# EAGLE board usb-fpga-1.20 (EAGLE 4.15), part 1 of 2
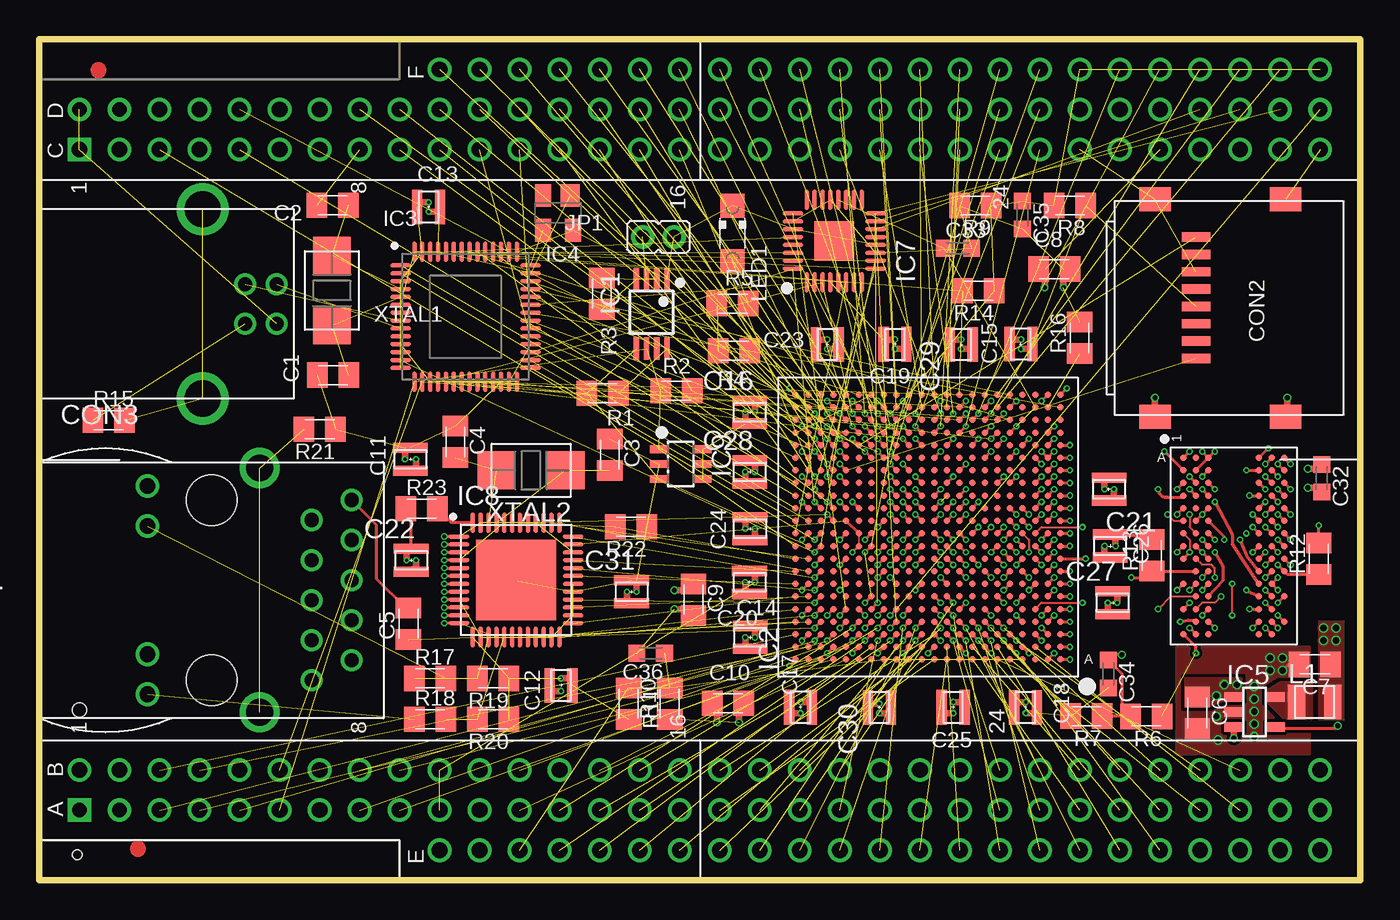
[diagram p8: board, top side]
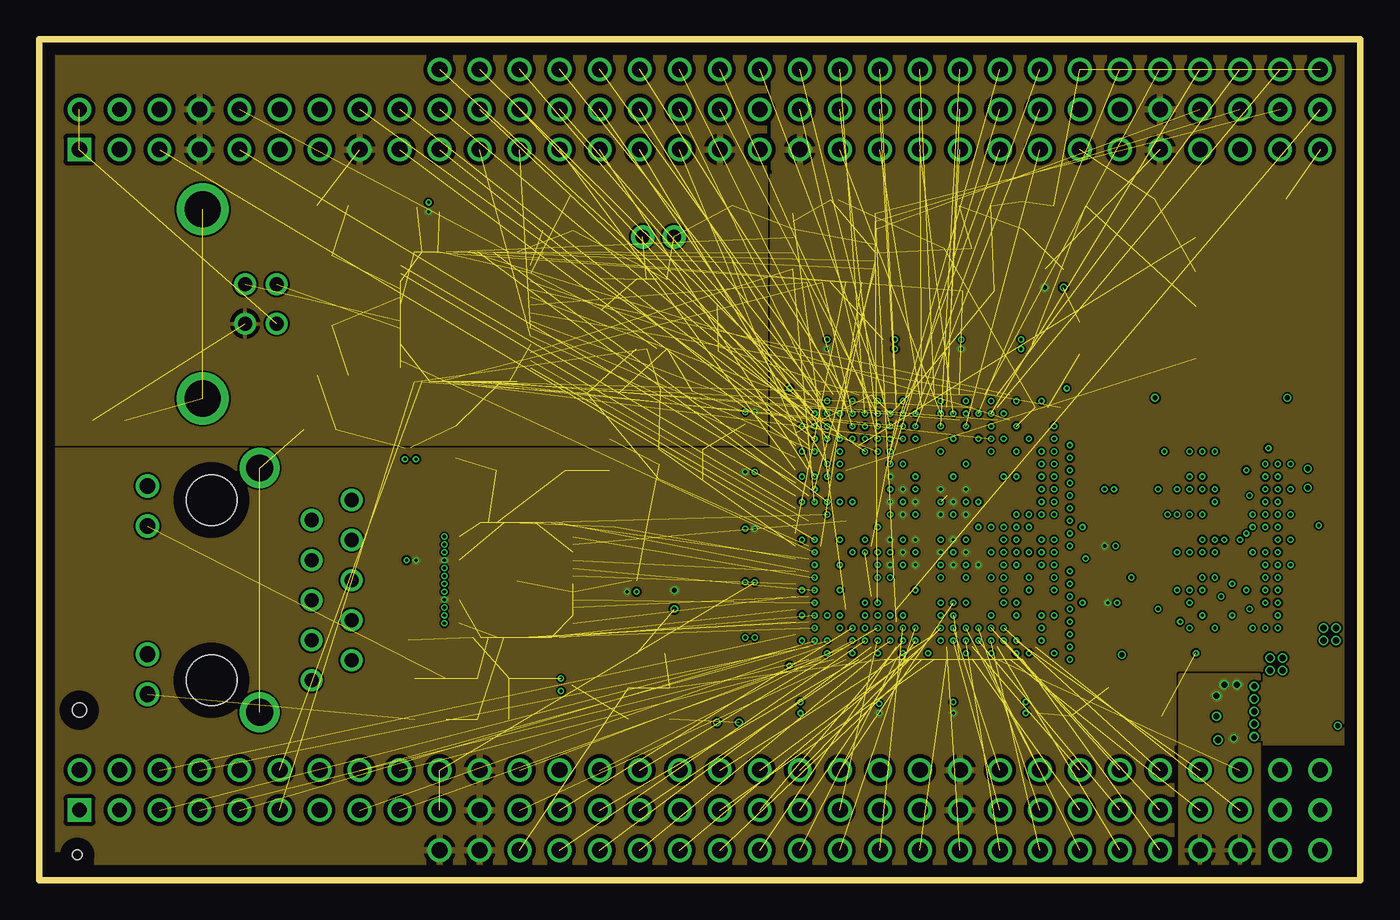
[diagram p9: board, inner layer Sup1]
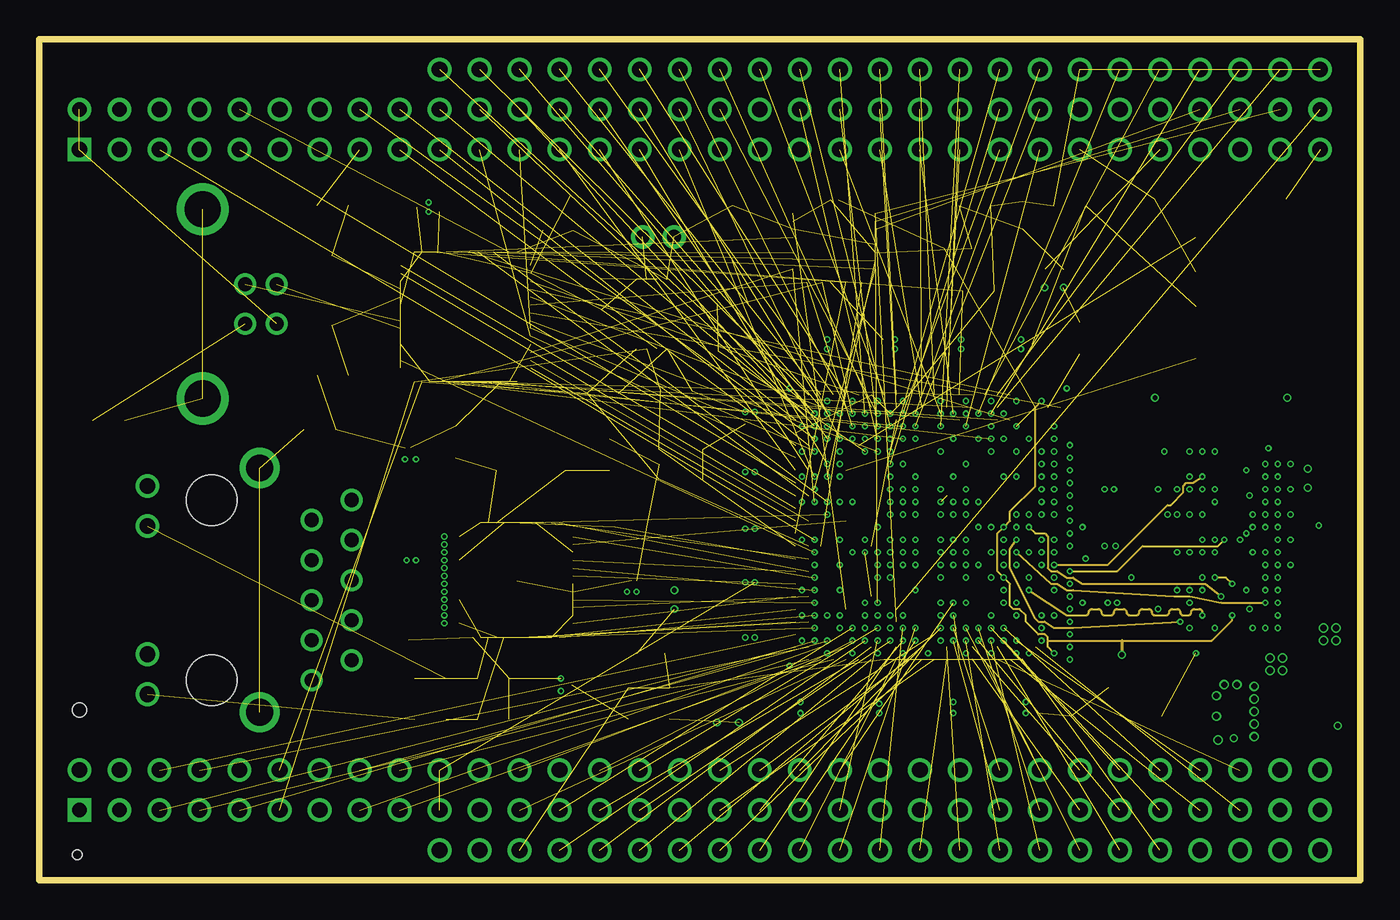
[diagram p10: board, inner layer Sig1]
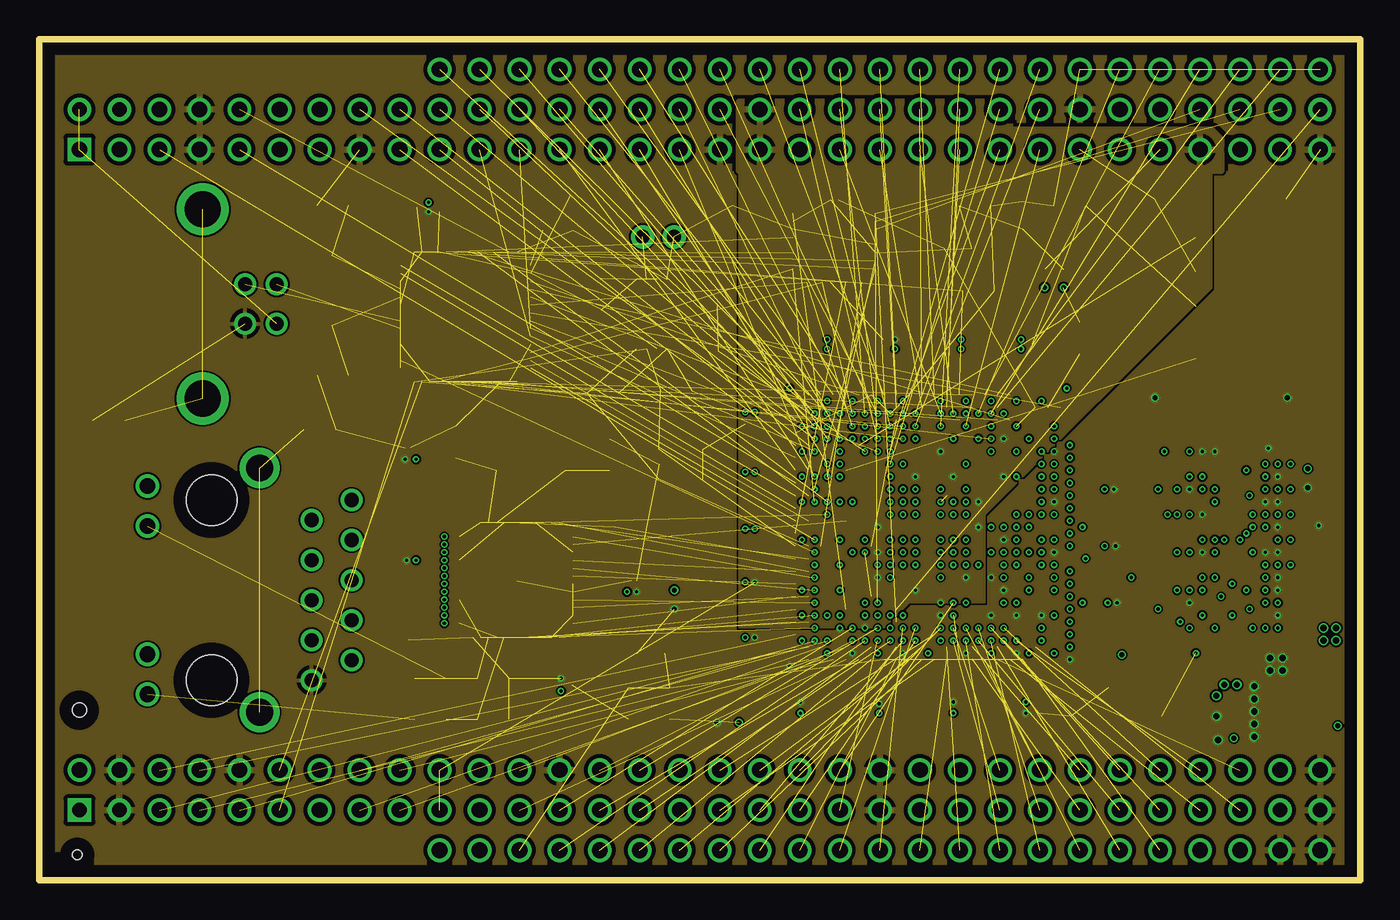
[diagram p11: board, inner layer Sup2]
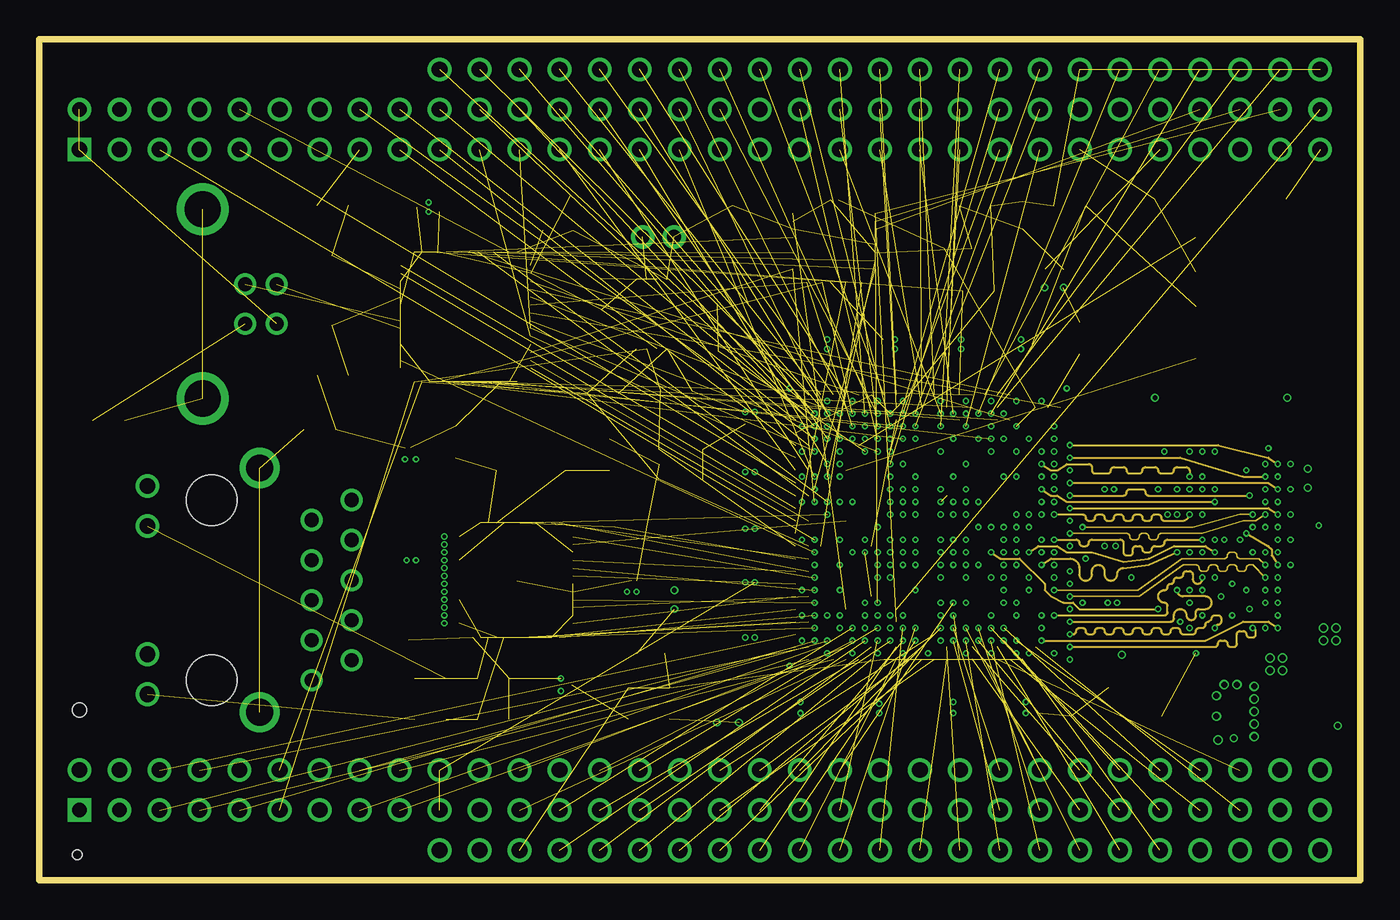
[diagram p12: board, inner layer Sig2]
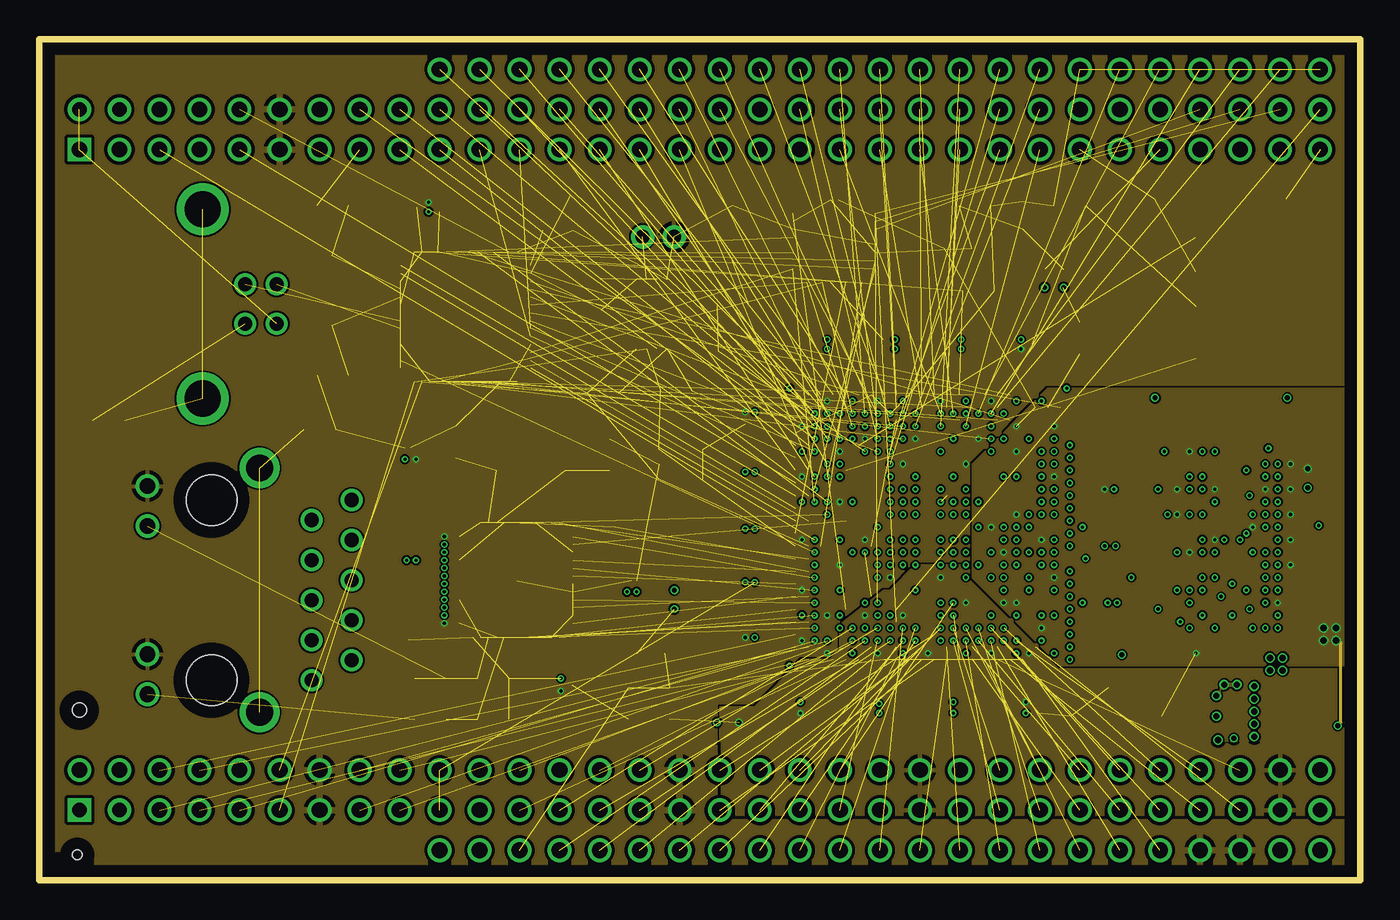
[diagram p13: board, inner layer Sup3]
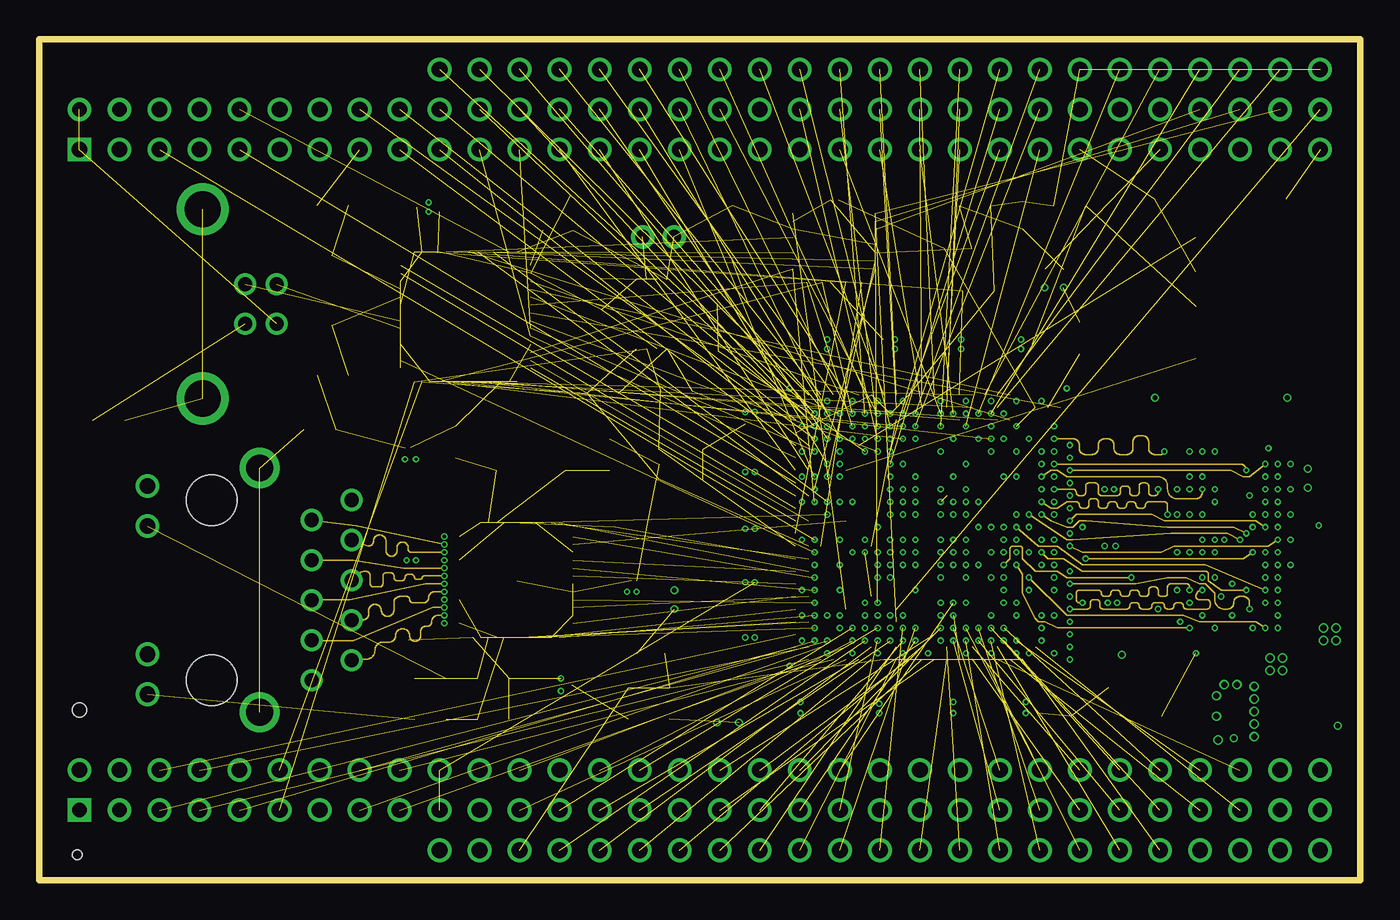
[diagram p14: board, inner layer Sig3]
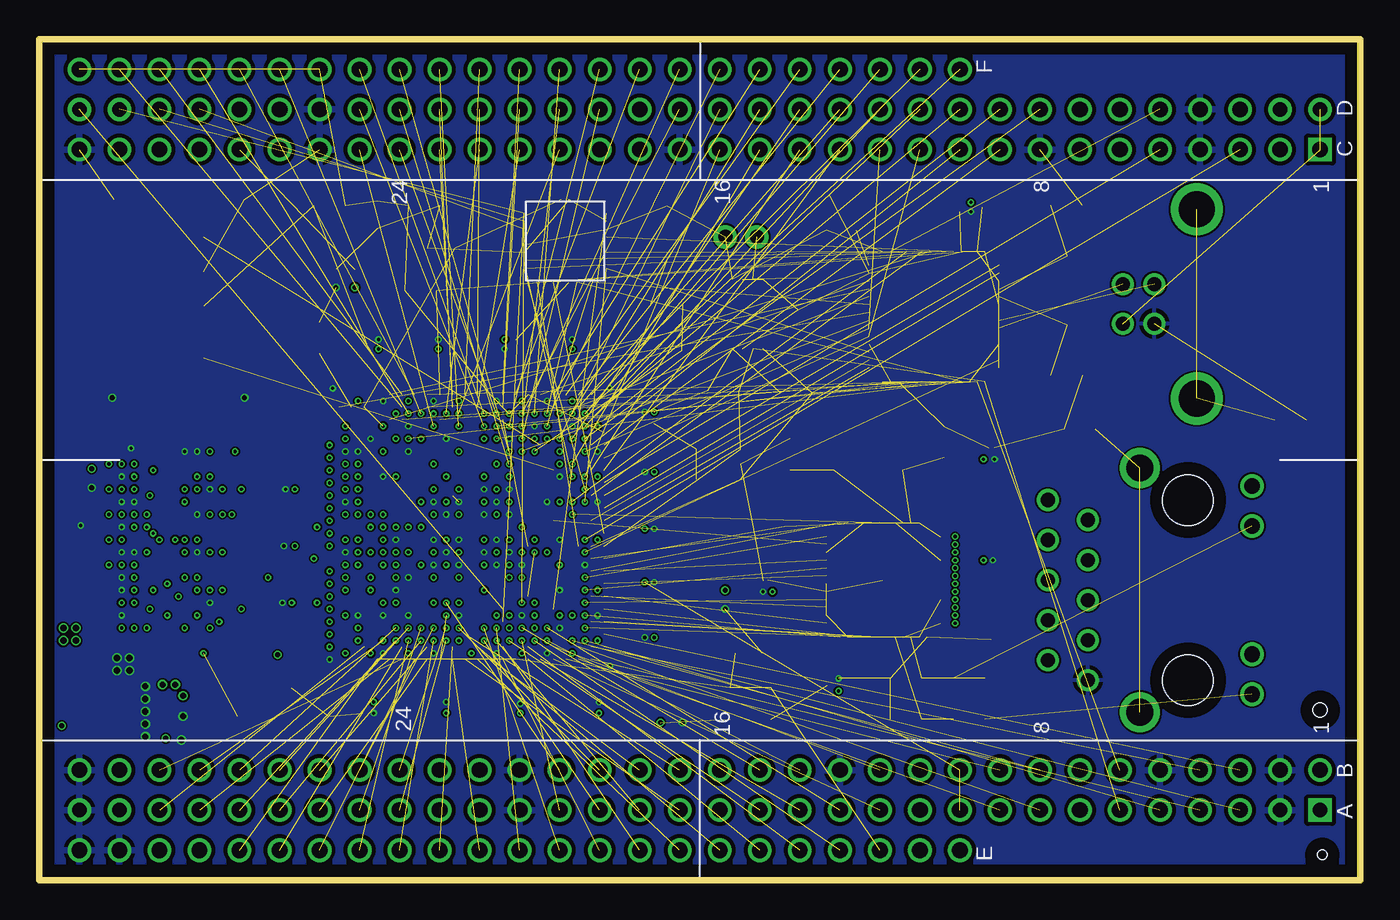
[diagram p15: board, bottom side, seen from below]

Size 83.82 x 53.34 mm. Coordinates in mm from the lower left corner, seen from the top.
Outline: 0,53.34 0,0 83.82,0 83.82,53.34 0,53.34
Copper layers (1+2*3+4*13+14*15+16): Top 0.035mm / dielectric 0.18mm / Sup1 0.035mm / dielectric 0.18mm / Sig1 0.035mm / dielectric 0.23mm / Sup2 0.035mm / dielectric 0.18mm / Sig2 0.035mm / dielectric 0.23mm / Sup3 0.035mm / dielectric 0.18mm / Sig3 0.035mm / dielectric 0.18mm / Sup4 (Bottom) 0.035mm
Design rules "dr": minimum track width 0.11mm, minimum drill 0.2mm, track to track 0.11mm, track to pad 0.125mm, pad to pad 0.125mm, via to via 0.1mm, smd to smd 2mil, copper to edge 31mil, drill to drill 0.3mm, minimum pad ring 10mil, minimum via ring 0.1mm, stop-mask expansion 3mil, vias tented up to drill 17mil, thermal gap 10mil
Net classes: 0 default: width 0.1 mm; 4 ddr: width 0.1 mm; 6 diff: width 0.11 mm
Holes 0.6 mm at 2.4,1.6

## Footprints (pad centres in the part's own frame; a part is rotated, then mirrored left to right if it is on the bottom)
C0805K = smd 1.3 x 1.6: 1 -1,0; 2 1,0
0508K = smd 2.2 x 0.65: P$1 0,-0.725; P$2 0,0.725
C0603K = smd 1.05 x 1.08: 1 -0.875,0; 2 0.875,0
USB-FPGA1.15 = drill 0.925 pad 1.5 square: A1 2.54,1.905 | drill 0.925 pad 1.5 round: A2 5.08,1.905; A31 78.74,1.905; A32 81.28,1.905; D1 2.54,46.355; D2 5.08,46.355; D31 78.74,46.355; D32 81.28,46.355 | drill 1 pad 1.5 round: A3 7.62,1.905; A4 10.16,1.905; A5 12.7,1.905; A6 15.24,1.905; A7 17.78,1.905; A8 20.32,1.905; A9 22.86,1.905; A10 25.4,1.905; A11 27.94,1.905; A12 30.48,1.905; A13 33.02,1.905; A14 35.56,1.905; A15 38.1,1.905; A16 40.64,1.905; A17 43.18,1.905; A18 45.72,1.905; A19 48.26,1.905; A20 50.8,1.905; A21 53.34,1.905; A22 55.88,1.905; A23 58.42,1.905; A24 60.96,1.905; A25 63.5,1.905; A26 66.04,1.905; A27 68.58,1.905; A28 71.12,1.905; A29 73.66,1.905; A30 76.2,1.905; B1 2.54,4.445; B2 5.08,4.445; B3 7.62,4.445; B4 10.16,4.445; B5 12.7,4.445; B6 15.24,4.445; B7 17.78,4.445; B8 20.32,4.445; B9 22.86,4.445; B10 25.4,4.445; B11 27.94,4.445; B12 30.48,4.445; B13 33.02,4.445; B14 35.56,4.445; B15 38.1,4.445; B16 40.64,4.445; B17 43.18,4.445; B18 45.72,4.445; B19 48.26,4.445; B20 50.8,4.445; B21 53.34,4.445; B22 55.88,4.445; B23 58.42,4.445; B24 60.96,4.445; B25 63.5,4.445; B26 66.04,4.445; B27 68.58,4.445; B28 71.12,4.445; B29 73.66,4.445; B30 76.2,4.445; B31 78.74,4.445; B32 81.28,4.445; C2 5.08,43.815; C3 7.62,43.815; C4 10.16,43.815; C5 12.7,43.815; C6 15.24,43.815; C7 17.78,43.815; C8 20.32,43.815; C9 22.86,43.815; C10 25.4,43.815; C11 27.94,43.815; C12 30.48,43.815; C13 33.02,43.815; C14 35.56,43.815; C15 38.1,43.815; C16 40.64,43.815; C17 43.18,43.815; C18 45.72,43.815; C19 48.26,43.815; C20 50.8,43.815; C21 53.34,43.815; C22 55.88,43.815; C23 58.42,43.815; C24 60.96,43.815; C25 63.5,43.815; C26 66.04,43.815; C27 68.58,43.815; C28 71.12,43.815; C29 73.66,43.815; C30 76.2,43.815; C31 78.74,43.815; C32 81.28,43.815; D3 7.62,46.355; D4 10.16,46.355; D5 12.7,46.355; D6 15.24,46.355; D7 17.78,46.355; D8 20.32,46.355; D9 22.86,46.355; D10 25.4,46.355; D11 27.94,46.355; D12 30.48,46.355; D13 33.02,46.355; D14 35.56,46.355; D15 38.1,46.355; D16 40.64,46.355; D17 43.18,46.355; D18 45.72,46.355; D19 48.26,46.355; D20 50.8,46.355; D21 53.34,46.355; D22 55.88,46.355; D23 58.42,46.355; D24 60.96,46.355; D25 63.5,46.355; D26 66.04,46.355; D27 68.58,46.355; D28 71.12,46.355; D29 73.66,46.355; D30 76.2,46.355; E10 25.4,-0.635; E11 27.94,-0.635; E12 30.48,-0.635; E13 33.02,-0.635; E14 35.56,-0.635; E15 38.1,-0.635; E16 40.64,-0.635; E17 43.18,-0.635; E18 45.72,-0.635; E19 48.26,-0.635; E20 50.8,-0.635; E21 53.34,-0.635; E22 55.88,-0.635; E23 58.42,-0.635; E24 60.96,-0.635; E25 63.5,-0.635; E26 66.04,-0.635; E27 68.58,-0.635; E28 71.12,-0.635; E29 73.66,-0.635; E30 76.2,-0.635; E31 78.74,-0.635; E32 81.28,-0.635; F10 25.4,48.895; F11 27.94,48.895; F12 30.48,48.895; F13 33.02,48.895; F14 35.56,48.895; F15 38.1,48.895; F16 40.64,48.895; F17 43.18,48.895; F18 45.72,48.895; F19 48.26,48.895; F20 50.8,48.895; F21 53.34,48.895; F22 55.88,48.895; F23 58.42,48.895; F24 60.96,48.895; F25 63.5,48.895; F26 66.04,48.895; F27 68.58,48.895; F28 71.12,48.895; F29 73.66,48.895; F30 76.2,48.895; F31 78.74,48.895; F32 81.28,48.895 | drill 1 pad 1.5 square: C1 2.54,43.815 | hole 0.9: 2.54,8.255
MICROSD-MULTICOMP = smd 0.6 x 1.8: 1 3.2,-1.85; 2 2.1,-1.85; 3 1,-1.85; 4 -0.1,-1.85; 5 -1.2,-1.85; 6 -2.3,-1.85; 7 -3.4,-1.85; 8 -4.5,-1.85 | smd 1.5 x 2: CD1 6.9,-4.45; CD2 -6.9,-4.45; SGD2 6.9,3.85; SHD1 -6.9,3.85
USB-HORIZ = drill 0.9 round: 1 15,-1.25; 2 15,1.25; 3 13,1.25; 4 13,-1.25 | drill 2.3 round: SHD1 10.3,6; SHD2 10.3,-6
RJ45-MAG = drill 0.9 round: 1 19.812,5.715; 2 17.272,4.445; 3 19.812,3.175; 4 17.272,1.905; 5 19.812,0.635; 6 17.272,-0.635; 7 19.812,-1.905; 8 17.272,-3.175; 9 19.812,-4.445; 10 17.272,-5.715 | drill 1 round: LED1A 6.858,6.604; LED1K 6.858,4.064; LED2A 6.858,-4.064; LED2K 6.858,-6.604 | drill 1.7 round: SH1 13.97,-7.747; SH2 13.97,7.747 | hole 3.2: 10.922,-5.715; 10.922,5.715
MSOP8 = smd 0.325 x 1.4: 1 -0.975,-2.2; 2 -0.325,-2.2; 3 0.325,-2.2; 4 0.975,-2.2; 5 0.975,2.2; 6 0.325,2.2; 7 -0.325,2.2; 8 -0.975,2.2
CSG484 = smd 0.4 x 0.4: A1 -8.4,8.4; A2 -7.6,8.4; A3 -6.8,8.4; A4 -6,8.4; A5 -5.2,8.4; A6 -4.4,8.4; A7 -3.6,8.4; A8 -2.8,8.4; A9 -2,8.4; A10 -1.2,8.4; A11 -0.4,8.4; A12 0.4,8.4; A13 1.2,8.4; A14 2,8.4; A15 2.8,8.4; A16 3.6,8.4; A17 4.4,8.4; A18 5.2,8.4; A19 6,8.4; A20 6.8,8.4; A21 7.6,8.4; A22 8.4,8.4; AA1 -8.4,-7.6; AA2 -7.6,-7.6; AA3 -6.8,-7.6; AA4 -6,-7.6; AA5 -5.2,-7.6; AA6 -4.4,-7.6; AA7 -3.6,-7.6; AA8 -2.8,-7.6; AA9 -2,-7.6; AA10 -1.2,-7.6; AA11 -0.4,-7.6; AA12 0.4,-7.6; AA13 1.2,-7.6; AA14 2,-7.6; AA15 2.8,-7.6; AA16 3.6,-7.6; AA17 4.4,-7.6; AA18 5.2,-7.6; AA19 6,-7.6; AA20 6.8,-7.6; AA21 7.6,-7.6; AA22 8.4,-7.6; AB1 -8.4,-8.4; AB2 -7.6,-8.4; AB3 -6.8,-8.4; AB4 -6,-8.4; AB5 -5.2,-8.4; AB6 -4.4,-8.4; AB7 -3.6,-8.4; AB8 -2.8,-8.4; AB9 -2,-8.4; AB10 -1.2,-8.4; AB11 -0.4,-8.4; AB12 0.4,-8.4; AB13 1.2,-8.4; AB14 2,-8.4; AB15 2.8,-8.4; AB16 3.6,-8.4; AB17 4.4,-8.4; AB18 5.2,-8.4; AB19 6,-8.4; AB20 6.8,-8.4; AB21 7.6,-8.4; AB22 8.4,-8.4; B1 -8.4,7.6; B2 -7.6,7.6; B3 -6.8,7.6; B4 -6,7.6; B5 -5.2,7.6; B6 -4.4,7.6; B7 -3.6,7.6; B8 -2.8,7.6; B9 -2,7.6; B10 -1.2,7.6; B11 -0.4,7.6; B12 0.4,7.6; B13 1.2,7.6; B14 2,7.6; B15 2.8,7.6; B16 3.6,7.6; B17 4.4,7.6; B18 5.2,7.6; B19 6,7.6; B20 6.8,7.6; B21 7.6,7.6; B22 8.4,7.6; C1 -8.4,6.8; C2 -7.6,6.8; C3 -6.8,6.8; C4 -6,6.8; C5 -5.2,6.8; C6 -4.4,6.8; C7 -3.6,6.8; C8 -2.8,6.8; C9 -2,6.8; C10 -1.2,6.8; C11 -0.4,6.8; C12 0.4,6.8; C13 1.2,6.8; C14 2,6.8; C15 2.8,6.8; C16 3.6,6.8; C17 4.4,6.8; C18 5.2,6.8; C19 6,6.8; C20 6.8,6.8; C21 7.6,6.8; C22 8.4,6.8; D1 -8.4,6; D2 -7.6,6; D3 -6.8,6; D4 -6,6; D5 -5.2,6; D6 -4.4,6; D7 -3.6,6; D8 -2.8,6; D9 -2,6; D10 -1.2,6; D11 -0.4,6; D12 0.4,6; D13 1.2,6; D14 2,6; D15 2.8,6; D16 3.6,6; D17 4.4,6; D18 5.2,6; D19 6,6; D20 6.8,6; D21 7.6,6; D22 8.4,6; E1 -8.4,5.2; E2 -7.6,5.2; E3 -6.8,5.2; E4 -6,5.2; E5 -5.2,5.2; E6 -4.4,5.2; E7 -3.6,5.2; E8 -2.8,5.2; E9 -2,5.2; E10 -1.2,5.2; E11 -0.4,5.2; E12 0.4,5.2; E13 1.2,5.2; E14 2,5.2; E15 2.8,5.2; E16 3.6,5.2; E17 4.4,5.2; E18 5.2,5.2; E19 6,5.2; E20 6.8,5.2; E21 7.6,5.2; E22 8.4,5.2; F1 -8.4,4.4; F2 -7.6,4.4; F3 -6.8,4.4; F4 -6,4.4; F5 -5.2,4.4; F6 -4.4,4.4; F7 -3.6,4.4; F8 -2.8,4.4; F9 -2,4.4; F10 -1.2,4.4; F11 -0.4,4.4; F12 0.4,4.4; F13 1.2,4.4; F14 2,4.4; F15 2.8,4.4; F16 3.6,4.4; F17 4.4,4.4; F18 5.2,4.4; F19 6,4.4; F20 6.8,4.4; F21 7.6,4.4; F22 8.4,4.4; G1 -8.4,3.6; G2 -7.6,3.6; G3 -6.8,3.6; G4 -6,3.6; G5 -5.2,3.6; G6 -4.4,3.6; G7 -3.6,3.6; G8 -2.8,3.6; G9 -2,3.6; G10 -1.2,3.6; G11 -0.4,3.6; G12 0.4,3.6; G13 1.2,3.6; G14 2,3.6; G15 2.8,3.6; G16 3.6,3.6; G17 4.4,3.6; G18 5.2,3.6; G19 6,3.6; G20 6.8,3.6; G21 7.6,3.6; G22 8.4,3.6; H1 -8.4,2.8; H2 -7.6,2.8; H3 -6.8,2.8; H4 -6,2.8; H5 -5.2,2.8; H6 -4.4,2.8; H7 -3.6,2.8; H8 -2.8,2.8; H9 -2,2.8; H10 -1.2,2.8; H11 -0.4,2.8; H12 0.4,2.8; H13 1.2,2.8; H14 2,2.8; H15 2.8,2.8; H16 3.6,2.8; H17 4.4,2.8; H18 5.2,2.8; H19 6,2.8; H20 6.8,2.8; H21 7.6,2.8; H22 8.4,2.8; J1 -8.4,2; J2 -7.6,2; J3 -6.8,2; J4 -6,2; J5 -5.2,2; J6 -4.4,2; J7 -3.6,2; J8 -2.8,2; J9 -2,2; J10 -1.2,2; J11 -0.4,2; J12 0.4,2; J13 1.2,2; J14 2,2; J15 2.8,2; J16 3.6,2; J17 4.4,2; J18 5.2,2; J19 6,2; J20 6.8,2; J21 7.6,2; J22 8.4,2; K1 -8.4,1.2; K2 -7.6,1.2; K3 -6.8,1.2; K4 -6,1.2; K5 -5.2,1.2; K6 -4.4,1.2; K7 -3.6,1.2; K8 -2.8,1.2; K9 -2,1.2; K10 -1.2,1.2; K11 -0.4,1.2; K12 0.4,1.2; K13 1.2,1.2; K14 2,1.2; K15 2.8,1.2; K16 3.6,1.2; K17 4.4,1.2; K18 5.2,1.2; K19 6,1.2; K20 6.8,1.2; K21 7.6,1.2; K22 8.4,1.2; L1 -8.4,0.4; L2 -7.6,0.4; L3 -6.8,0.4; L4 -6,0.4; L5 -5.2,0.4; L6 -4.4,0.4; L7 -3.6,0.4; L8 -2.8,0.4; L9 -2,0.4; L10 -1.2,0.4; L11 -0.4,0.4; L12 0.4,0.4; L13 1.2,0.4; L14 2,0.4; L15 2.8,0.4; L16 3.6,0.4; L17 4.4,0.4; L18 5.2,0.4; L19 6,0.4; L20 6.8,0.4; L21 7.6,0.4; L22 8.4,0.4; M1 -8.4,-0.4; M2 -7.6,-0.4; M3 -6.8,-0.4; M4 -6,-0.4; M5 -5.2,-0.4; M6 -4.4,-0.4; M7 -3.6,-0.4; M8 -2.8,-0.4; M9 -2,-0.4; M10 -1.2,-0.4; M11 -0.4,-0.4; M12 0.4,-0.4; M13 1.2,-0.4; M14 2,-0.4; M15 2.8,-0.4; M16 3.6,-0.4; M17 4.4,-0.4; M18 5.2,-0.4; M19 6,-0.4; M20 6.8,-0.4; M21 7.6,-0.4; M22 8.4,-0.4; N1 -8.4,-1.2; N2 -7.6,-1.2; N3 -6.8,-1.2; N4 -6,-1.2; N5 -5.2,-1.2; N6 -4.4,-1.2; N7 -3.6,-1.2; N8 -2.8,-1.2; N9 -2,-1.2; N10 -1.2,-1.2; N11 -0.4,-1.2; N12 0.4,-1.2; N13 1.2,-1.2; N14 2,-1.2; N15 2.8,-1.2; N16 3.6,-1.2; N17 4.4,-1.2; N18 5.2,-1.2; N19 6,-1.2; N20 6.8,-1.2; N21 7.6,-1.2; N22 8.4,-1.2; P1 -8.4,-2; P2 -7.6,-2; P3 -6.8,-2; P4 -6,-2; P5 -5.2,-2; P6 -4.4,-2; P7 -3.6,-2; P8 -2.8,-2; P9 -2,-2; P10 -1.2,-2; P11 -0.4,-2; P12 0.4,-2; P13 1.2,-2; P14 2,-2; P15 2.8,-2; P16 3.6,-2; P17 4.4,-2; P18 5.2,-2; P19 6,-2; P20 6.8,-2; P21 7.6,-2; P22 8.4,-2; R1 -8.4,-2.8; R2 -7.6,-2.8; R3 -6.8,-2.8; R4 -6,-2.8; R5 -5.2,-2.8; R6 -4.4,-2.8; R7 -3.6,-2.8; R8 -2.8,-2.8; R9 -2,-2.8; R10 -1.2,-2.8; R11 -0.4,-2.8; R12 0.4,-2.8; R13 1.2,-2.8; R14 2,-2.8; R15 2.8,-2.8; R16 3.6,-2.8; R17 4.4,-2.8; R18 5.2,-2.8; R19 6,-2.8; R20 6.8,-2.8; R21 7.6,-2.8; R22 8.4,-2.8; T1 -8.4,-3.6; T2 -7.6,-3.6; T3 -6.8,-3.6; T4 -6,-3.6; T5 -5.2,-3.6; T6 -4.4,-3.6; T7 -3.6,-3.6; T8 -2.8,-3.6; T9 -2,-3.6; T10 -1.2,-3.6; T11 -0.4,-3.6; T12 0.4,-3.6; T13 1.2,-3.6; T14 2,-3.6; T15 2.8,-3.6; T16 3.6,-3.6; T17 4.4,-3.6; T18 5.2,-3.6; T19 6,-3.6; T20 6.8,-3.6; T21 7.6,-3.6; T22 8.4,-3.6; U1 -8.4,-4.4; U2 -7.6,-4.4; U3 -6.8,-4.4; U4 -6,-4.4; U5 -5.2,-4.4; U6 -4.4,-4.4; U7 -3.6,-4.4; U8 -2.8,-4.4; U9 -2,-4.4; U10 -1.2,-4.4; U11 -0.4,-4.4; U12 0.4,-4.4; U13 1.2,-4.4; U14 2,-4.4; U15 2.8,-4.4; U16 3.6,-4.4; U17 4.4,-4.4; U18 5.2,-4.4; U19 6,-4.4; U20 6.8,-4.4; U21 7.6,-4.4; U22 8.4,-4.4; V1 -8.4,-5.2; V2 -7.6,-5.2; V3 -6.8,-5.2; V4 -6,-5.2; V5 -5.2,-5.2; V6 -4.4,-5.2; V7 -3.6,-5.2; V8 -2.8,-5.2; V9 -2,-5.2; V10 -1.2,-5.2; V11 -0.4,-5.2; V12 0.4,-5.2; V13 1.2,-5.2; V14 2,-5.2; V15 2.8,-5.2; V16 3.6,-5.2; V17 4.4,-5.2; V18 5.2,-5.2; V19 6,-5.2; V20 6.8,-5.2; V21 7.6,-5.2; V22 8.4,-5.2; W1 -8.4,-6; W2 -7.6,-6; W3 -6.8,-6; W4 -6,-6; W5 -5.2,-6; W6 -4.4,-6; W7 -3.6,-6; W8 -2.8,-6; W9 -2,-6; W10 -1.2,-6; W11 -0.4,-6; W12 0.4,-6; W13 1.2,-6; W14 2,-6; W15 2.8,-6; W16 3.6,-6; W17 4.4,-6; W18 5.2,-6; W19 6,-6; W20 6.8,-6; W21 7.6,-6; W22 8.4,-6; Y1 -8.4,-6.8; Y2 -7.6,-6.8; Y3 -6.8,-6.8; Y4 -6,-6.8; Y5 -5.2,-6.8; Y6 -4.4,-6.8; Y7 -3.6,-6.8; Y8 -2.8,-6.8; Y9 -2,-6.8; Y10 -1.2,-6.8; Y11 -0.4,-6.8; Y12 0.4,-6.8; Y13 1.2,-6.8; Y14 2,-6.8; Y15 2.8,-6.8; Y16 3.6,-6.8; Y17 4.4,-6.8; Y18 5.2,-6.8; Y19 6,-6.8; Y20 6.8,-6.8; Y21 7.6,-6.8; Y22 8.4,-6.8
QFN-56 = smd 1.3 x 0.25: 1 -4.125,3.25; 2 -4.125,2.75; 3 -4.125,2.25; 4 -4.125,1.75; 5 -4.125,1.25; 6 -4.125,0.75; 7 -4.125,0.25; 8 -4.125,-0.25; 9 -4.125,-0.75; 10 -4.125,-1.25; 11 -4.125,-1.75; 12 -4.125,-2.25; 13 -4.125,-2.75; 14 -4.125,-3.25; 29 4.125,-3.25; 30 4.125,-2.75; 31 4.125,-2.25; 32 4.125,-1.75; 33 4.125,-1.25; 34 4.125,-0.75; 35 4.125,-0.25; 36 4.125,0.25; 37 4.125,0.75; 38 4.125,1.25; 39 4.125,1.75; 40 4.125,2.25; 41 4.125,2.75; 42 4.125,3.25 | smd 0.25 x 1.3: 15 -3.25,-4.125; 16 -2.75,-4.125; 17 -2.25,-4.125; 18 -1.75,-4.125; 19 -1.25,-4.125; 20 -0.75,-4.125; 21 -0.25,-4.125; 22 0.25,-4.125; 23 0.75,-4.125; 24 1.25,-4.125; 25 1.75,-4.125; 26 2.25,-4.125; 27 2.75,-4.125; 28 3.25,-4.125; 43 3.25,4.125; 44 2.75,4.125; 45 2.25,4.125; 46 1.75,4.125; 47 1.25,4.125; 48 0.75,4.125; 49 0.25,4.125; 50 -0.25,4.125; 51 -0.75,4.125; 52 -1.25,4.125; 53 -1.75,4.125; 54 -2.25,4.125; 55 -2.75,4.125; 56 -3.25,4.125
SOT143 = smd 1.2 x 1.44: 1 -0.75,-1.1 | smd 1 x 1.44: 2 0.95,-1.1; 3 0.95,1.1; 4 -0.95,1.1
SOT23-5 = smd 0.6 x 1.2: 1 -0.95,-1.306; 2 0,-1.306; 3 0.95,-1.306; 4 0.95,1.306; 5 -0.95,1.306
FBGA84 = smd 0.4 x 0.4: A1 -3.2,5.6; A2 -2.4,5.6; A3 -1.6,5.6; A7 1.6,5.6; A8 2.4,5.6; A9 3.2,5.6; B1 -3.2,4.8; B2 -2.4,4.8; B3 -1.6,4.8; B7 1.6,4.8; B8 2.4,4.8; B9 3.2,4.8; C1 -3.2,4; C2 -2.4,4; C3 -1.6,4; C7 1.6,4; C8 2.4,4; C9 3.2,4; D1 -3.2,3.2; D2 -2.4,3.2; D3 -1.6,3.2; D7 1.6,3.2; D8 2.4,3.2; D9 3.2,3.2; E1 -3.2,2.4; E2 -2.4,2.4; E3 -1.6,2.4; E7 1.6,2.4; E8 2.4,2.4; E9 3.2,2.4; F1 -3.2,1.6; F2 -2.4,1.6; F3 -1.6,1.6; F7 1.6,1.6; F8 2.4,1.6; F9 3.2,1.6; G1 -3.2,0.8; G2 -2.4,0.8; G3 -1.6,0.8; G7 1.6,0.8; G8 2.4,0.8; G9 3.2,0.8; H1 -3.2,0; H2 -2.4,0; H3 -1.6,0; H7 1.6,0; H8 2.4,0; H9 3.2,0; J1 -3.2,-0.8; J2 -2.4,-0.8; J3 -1.6,-0.8; J7 1.6,-0.8; J8 2.4,-0.8; J9 3.2,-0.8; K2 -2.4,-1.6; K3 -1.6,-1.6; K7 1.6,-1.6; K8 2.4,-1.6; K9 3.2,-1.6; L1 -3.2,-2.4; L2 -2.4,-2.4; L3 -1.6,-2.4; L7 1.6,-2.4; L8 2.4,-2.4; M2 -2.4,-3.2; M3 -1.6,-3.2; M7 1.6,-3.2; M8 2.4,-3.2; M9 3.2,-3.2; N1 -3.2,-4; N2 -2.4,-4; N3 -1.6,-4; N7 1.6,-4; N8 2.4,-4; P2 -2.4,-4.8; P3 -1.6,-4.8; P7 1.6,-4.8; P8 2.4,-4.8; P9 3.2,-4.8; R1 -3.2,-5.6; R2 -2.4,-5.6; R3 -1.6,-5.6; R7 1.6,-5.6; R8 2.4,-5.6
QFG32 = smd 1.3 x 0.25: 1 -2.625,1.75; 2 -2.625,1.25; 3 -2.625,0.75; 4 -2.625,0.25; 5 -2.625,-0.25; 6 -2.625,-0.75; 7 -2.625,-1.25; 8 -2.625,-1.75; 17 2.625,-1.75; 18 2.625,-1.25; 19 2.625,-0.75; 20 2.625,-0.25; 21 2.625,0.25; 22 2.625,0.75; 23 2.625,1.25; 24 2.625,1.75 | smd 0.25 x 1.3: 9 -1.75,-2.625; 10 -1.25,-2.625; 11 -0.75,-2.625; 12 -0.25,-2.625; 13 0.25,-2.625; 14 0.75,-2.625; 15 1.25,-2.625; 16 1.75,-2.625; 25 1.75,2.625; 26 1.25,2.625; 27 0.75,2.625; 28 0.25,2.625; 29 -0.25,2.625; 30 -0.75,2.625; 31 -1.25,2.625; 32 -1.75,2.625 | smd 2.5 x 2.5: TH 0,0
QFN48 = smd 1.3 x 0.25: 1 -3.625,2.75; 2 -3.625,2.25; 3 -3.625,1.75; 4 -3.625,1.25; 5 -3.625,0.75; 6 -3.625,0.25; 7 -3.625,-0.25; 8 -3.625,-0.75; 9 -3.625,-1.25; 10 -3.625,-1.75; 11 -3.625,-2.25; 12 -3.625,-2.75; 25 3.625,-2.75; 26 3.625,-2.25; 27 3.625,-1.75; 28 3.625,-1.25; 29 3.625,-0.75; 30 3.625,-0.25; 31 3.625,0.25; 32 3.625,0.75; 33 3.625,1.25; 34 3.625,1.75; 35 3.625,2.25; 36 3.625,2.75 | smd 0.25 x 1.3: 13 -2.75,-3.625; 14 -2.25,-3.625; 15 -1.75,-3.625; 16 -1.25,-3.625; 17 -0.75,-3.625; 18 -0.25,-3.625; 19 0.25,-3.625; 20 0.75,-3.625; 21 1.25,-3.625; 22 1.75,-3.625; 23 2.25,-3.625; 24 2.75,-3.625; 37 2.75,3.625; 38 2.25,3.625; 39 1.75,3.625; 40 1.25,3.625; 41 0.75,3.625; 42 0.25,3.625; 43 -0.25,3.625; 44 -0.75,3.625; 45 -1.25,3.625; 46 -1.75,3.625; 47 -2.25,3.625; 48 -2.75,3.625 | smd 5.1 x 5.1: PADDLE 0,0
SOT23-6 = smd 0.5 x 1.1: 1 -0.95,-1.4; 2 0,-1.4; 3 0.95,-1.4; 4 0.95,1.4; 5 0,1.4; 6 -0.95,1.4
JP1R2MM = drill 0.9 pad 1.5 round: 1 0,-1; 2 0,1
L1008 = smd 1.1 x 2.2: P$1 -1.15,0; P$2 1.15,0
LED1206-A_MARK = smd 1.5 x 1.5: A 0,-1.75; C 0,1.75
R0805K = smd 1.3 x 1.6: 1 -1,0; 2 1,0
CRYSTAL-HU29 = smd 2.4 x 2.4: P$1 -2.2,0; P$2 2.2,0

## Placement (x,y rotation side)
C1  12p  [C0805K]  18.64,32.05 0 top
C2  12p  [C0805K]  18.62,42.82 0 top
C3  12p  [C0805K]  36.2,27 270 top
C4  12p  [C0805K]  26.4,27.8 270 top
C5  100n  [C0805K]  23.42,16.26 90 top
C6  22µ  [C0805K]  73.49,10.61 270 top
C7  22µ  [C0805K]  80.95,13.69 180 top
C8  22µ  [C0805K]  64.41,38.77 0 top
C9  22µ  [C0805K]  41.51,17.8 270 top
C10  22µ  [C0805K]  43.71,11.21 180 top
C11  4µ7  [0508K]  23.55,26.7 0 top
C12  4µ7  [0508K]  33.1,12.35 270 top
C13  4µ7  [0508K]  24.7,42.7 270 top
C14  4µ7  [0508K]  45.11,15.4 0 top
C15  4µ7  [0508K]  62.3,34.01 90 top
C16  4µ7  [0508K]  45.09,29.69 0 top
C17  4µ7  [0508K]  48.31,10.97 270 top
C18  4µ7  [0508K]  62.59,10.96 270 top
C19  4µ7  [0508K]  54.3,34 270 top
C20  4µ7  [0508K]  45.07,18.9 180 top
C21  4µ7  [0508K]  67.88,24.81 180 top
C22  4µ7  [0508K]  23.59,20.29 0 top
C23  4µ7  [0508K]  50.01,33.99 90 top
C24  4µ7  [0508K]  45.1,22.3 0 top
C25  4µ7  [0508K]  57.99,10.97 270 top
C26  4µ7  [0508K]  67.95,21.2 0 top
C27  4µ7  [0508K]  68.11,17.6 0 top
C28  4µ7  [0508K]  45.08,25.9 0 top
C29  4µ7  [0508K]  58.51,33.98 90 top
C30  4µ7  [0508K]  53.31,10.96 90 top
C31  4µ7  [0508K]  37.58,18.3 0 top
C32  1µ  [C0603K]  81.4,25.5 270 top
C33  1µ  [C0603K]  58.3,40.1 0 top
C34  1µ  [C0603K]  67.83,13.08 270 top
C35  1µ  [C0603K]  62.4,42.2 270 top
C36  1µ  [C0603K]  38.8,14.4 180 top
CON1  1GBE-USB-FPGA1.20  [USB-FPGA1.15]  0,2.54 0 top
CON2  MICROSDMC  [MICROSD-MULTICOMP]  75.25,36.3 270 top
CON3  USB-THTHORIZ  [USB-HORIZ]  0.06,36.56 0 top
CON4  RJ45MAG  [RJ45-MAG]  0,18.4 0 top
IC1  CAT24C128Z  [MSOP8]  38.86,35.93 180 top
IC2  XC6SLX-CSG484CSG484  [CSG484]  56.4,22.4 180 top
IC3  FX2-Q56  [QFN-56]  27.05,35.75 0 top
IC4  3.08V  [SOT143]  32.92,42.33 180 top
IC5  [SOT23-5]  77.12,10.66 270 top
IC6  DDR2_SDRAM-X16FBGA84  [FBGA84]  75.8,21.2 0 top
IC7  XC2C-QFG32QFG32  [QFG32]  50.45,40.55 90 top
IC8  KSZ9021RN  [QFN48]  30.25,19.05 0 top
IC9  24AA025E48/OT  [SOT23-6]  40.71,26.4 270 top
JP1  [JP1R2MM]  39.28,40.81 270 top
L1  1.5µ  [L1008]  80.94,11.29 0 top
LED1  [LED1206-A_MARK]  43.99,41.03 180 top
R1  2K4  [R0805K]  35.75,30.88 0 top
R2  2K4  [R0805K]  40.42,31.05 0 top
R3  2K4  [R0805K]  35.69,37.2 270 top
R4  680  [R0805K]  44.08,33.59 180 top
R5  220  [R0805K]  44,36.58 0 top
R6  68  [R0805K]  70.25,10.39 180 top
R7  68  [R0805K]  66.45,10.41 180 top
R8  220  [R0805K]  65.4,42.8 180 top
R9  220  [R0805K]  59.4,42.8 180 top
R10  220  [R0805K]  40,11.2 90 top
R11  220  [R0805K]  37.4,11.2 270 top
R12  5K4  [R0805K]  81.2,20.4 90 top
R13  5K4  [R0805K]  70.6,20.6 90 top
R14  680  [R0805K]  59.6,37.4 180 top
R15  0  [R0805K]  4.4,29.18 0 top
R16  100  [R0805K]  66.02,34.4 90 top
R17  220  [R0805K]  24.8,12.8 0 top
R18  220  [R0805K]  24.8,10.2 0 top
R19  680  [R0805K]  28.8,12.8 180 top
R20  680  [R0805K]  28.8,10.2 180 top
R21  0  [R0805K]  17.8,28.6 180 top
R22  2k4  [R0805K]  37.54,22.42 180 top
R23  4k99  [R0805K]  24.26,23.56 0 top
U$14  [MARKER-ROUND-1X3]  6.25,2 0 top
U$15  [MARKER-ROUND-1X3]  88.1,12.66 0 top  (outside the outline)
U$16  [MARKER-ROUND-1X3]  88.11,39.53 0 top  (outside the outline)
U$17  [MARKER-ROUND-1X3]  3.75,51.38 0 top
XTAL1  24MHz  [CRYSTAL-HU29]  18.57,37.42 90 top
XTAL2  25MHz  [CRYSTAL-HU29]  31.2,26 180 top